# Altium schematic sheet Main.SchDoc
size 381 x 241 mm; SheetNumber: 1; SheetTotal: 1
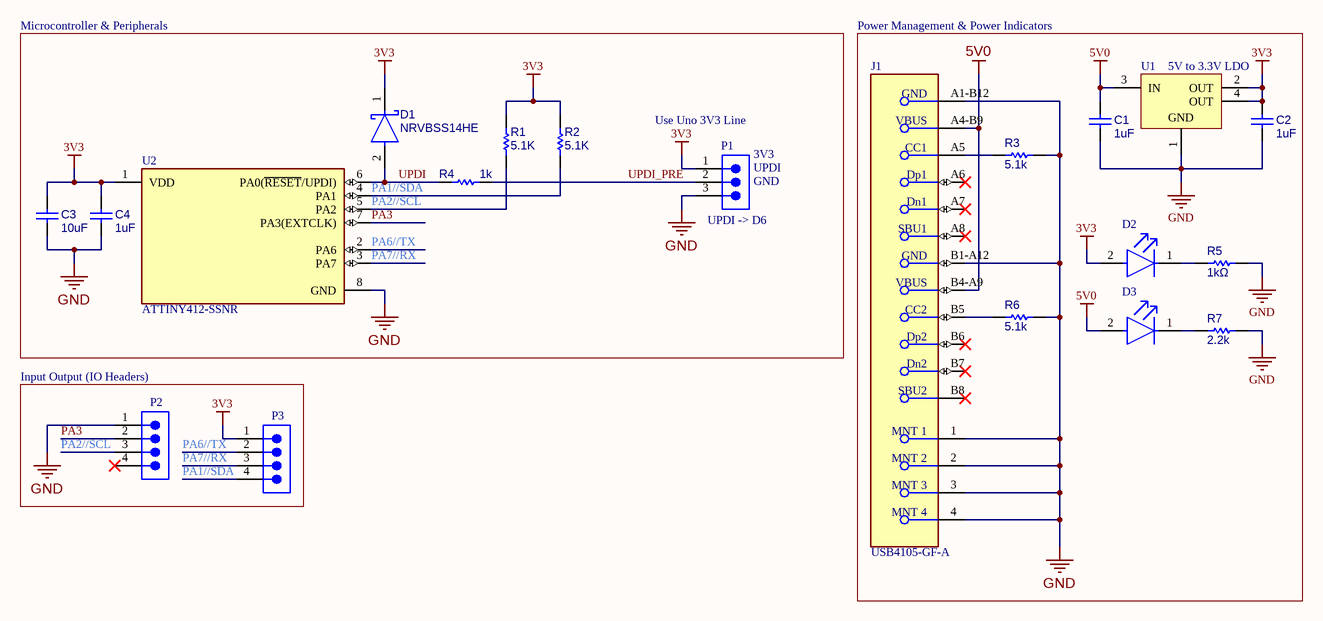
[diagram p0: Main.SchDoc]

## Parts
C1  1uF  [WCAP-CSGP_0603_L1.6W0.8H0.8_Reflow]
C2  1uF  [WCAP-CSGP_0603_L1.6W0.8H0.8_Reflow]
C3  10uF  [WCAP-CSGP_0603_L1.6W0.8H0.8_Reflow]
C4  1uF  [WCAP-CSGP_0603_L1.6W0.8H0.8_Reflow]
D1  NRVBSS14HE  [FP-477AD-MFG]
D2  LTST-C190KGKT  [FP-LTST-C190KGKT-MFG]  (value not drawn)
D3  LTST-C190KGKT  [FP-LTST-C190KGKT-MFG]  (value not drawn)
J1  USB4105-GF-A  [FP-USB4105-GF-A-MFG]
P1  61300311121  [61300311121]  (value not drawn)
P2  61300411121  [61300411121]  (value not drawn)
P3  61300411121  [61300411121]  (value not drawn)
R1  5.1K  [RESC1608X55X25NL10T15]
R2  5.1K  [RESC1608X55X25NL10T15]
R3  5.1k  [RESC1608X55X25NL10T15]
R4  1k  [RESC1608X55X25NL10T15]
R5  1kΩ  [RESC1608X55X25NL10T15]
R6  5.1k  [RESC1608X55X25NL10T15]
R7  2.2k  [RESC1608X55X25NL10T15]
U1  TLV1117LV33DCYR  [DCY0004A_N]  (value not drawn)
U2  ATTINY412-SSNR  [FP-C04-057-SN-MFG]

## Blocks framed on the sheet
Input Output (IO Headers): P2 P3

## Nets
3V3: C2.2 C3.2 C4.2 D1.1(C) D2.2(A) P1.1 P3.1 R1.1 R2.1 U1.2(OUT) U1.4(OUT) U2.1(VDD)
5V0: C1.2 D3.2(A) J1.A4-B9(VBUS) J1.B4-A9(VBUS) U1.3(IN)
GND: C1.1 C2.1 C3.1 C4.1 J1.1(MNT_1) J1.2(MNT_2) J1.3(MNT_3) J1.4(MNT_4) J1.A1-B12(GND) J1.B1-A12(GND) P1.3 P2.1 R3.1 R5.1 R6.1 R7.1 U1.1(GND) U2.8(GND)
PA1//SDA: P3.4 R2.2 U2.4(PA1)
PA2//SCL: P2.3 R1.2 U2.5(PA2)
PA3: P2.2 U2.7(PA3(EXTCLK))
PA6//TX: P3.2 U2.2(PA6)
PA7//RX: P3.3 U2.3(PA7)
UPDI: D1.2(A) R4.2 U2.6(PA0(~{RESET}/UPDI))
UPDI_PRE: P1.2 R4.1
NetD2_1: D2.1(C) R5.2
NetD3_1: D3.1(C) R7.2
NetJ1_A5: J1.A5(CC1) R3.2
NetJ1_B5: J1.B5(CC2) R6.2

Not connected (* = marked no-connect by the designer): J1 A6(Dp1)* A7(Dn1)* A8(SBU1)* B6(Dp2)* B7(Dn2)* B8(SBU2)*; P2 4*

## Notes on the sheet
- Microcontroller & Peripherals
- Power Management & Power Indicators
- (near U1) 5V to 3.3V LDO
- (near P1) Use Uno 3V3 Line
- (near P1) UPDI -> D6
- (near P1) UPDI
- (near P1) GND
- (near P1) 3V3

## Library data of the parts
C1-C4 = CMP-207839-000060-3: 10V tolerance
D1 = CMP-00278-93203856-2: NRVBSS14HE Rectifier Diode, Schottky, 1 Phase, 1 Element, 1A, 40V V(RRM), Silicon; Manufacturer Lifecycle Status: ACTIVE; Capacitance: 55pF; Max Forward Surge Current (Ifsm): 25A; Peak Reverse Current: 5µA; Max Junction Temperature (Tj): 150°C; Forward Current: 1A; Min Operating Temperature: -55°C; NexarPartId: 93203856; Reverse Voltage: 40V; Max Operating Temperature: 150°C; RoHS: Compliant; Lifecycle Status: Production; Max Repetitive Reverse Voltage (Vrrm): 40V; Height: 750µm
D2 D3 = CMP-2000-05197-2: LED GREEN CLEAR CHIP SMD; Test Current: 20mA; Power Rating: 75mW; Forward Voltage: 2V; Wavelength: 574nm; Number of LEDs: 1; Reverse Voltage: 5V; Dominant Wavelength: 571nm; Lens Style: Diffused; Luminous Intensity: 35mcd; Forward Current: 30mA; Viewing Angle: 130°; Lens Color: Colorless; Width: 0.8mm; Case Code (Imperial): 0603; Case Code (Metric): 1608; Number of Pins: 2; Radiation Hardening: No; Package Quantity: 1; Lead Free: Lead Free; Lens Transparency: Clear; Depth: 0.8mm; Power Dissipation: 75mW; Mount: Surface Mount; Max Operating Temperature: 85°C; Case/Package: 0603; Height: 0.8mm; Illumination Color: Green; Color: Green; Length: 1.6mm; Packaging: Tape and Reel; Number of Elements: 1; Min Operating Temperature: -55°C
J1 = CMP-245163-000001-1: CONN RCPT USB2.0 TYPEC 5A; Manufacturer: GCT; Voltage Rating: 20V; Is Female: yes; Current Rating: 5/6.25/1.25/0.25A; Number Of Contacts: 16; Conn Orientation: Right Angle; Device Class L1: Connectors; Category: Conn; Lead Free: Yes; RoHS: TRUE; Temperature Range High: +85°C; Digikey Description: CONN RCPT USB2.0 TYPEC 5A; Device Class L3: unset; ComponentLink2Description: Datasheet; Manufacturer Part Number: USB4105-GF-A; Package: 0; Usb Standard: USB 2.0; Device Class L2: USB Connectors; Automotive: No; Temperature Range Low: -40°C; Height: 3.46mm; Temperature: -40°C to +85°C; Contact Material: Gold,Nickel; ComponentLink2URL: https://gct.co/files/drawings/usb4105.pdf; Octopart: https://octopart.com/usb4105-gf-a-gct-106627878
P1 = CMP-1502-01062-3: NexarPartId: 32855521; Current Rating: 3A; Voltage Rating: 250V; Number of Positions: 3; Pitch: 2.54mm; Contact Resistance: 20mΩ; Connector Type: Male Pin; Gender: Male; REACH SVHC: Unknown; Packaging: Bulk; Contact Material: Copper; Min Operating Temperature: -40°C; Number of Rows: 1; Orientation: Vertical; RoHS: Compliant; Contact Plating: Gold; Max Operating Temperature: 105°C; Mount: Through Hole; Height: 8.94mm; Operating Supply Voltage: 250V; Number of Pins: 3; Contact Mating Length: 5.9944mm; Number of Contacts: 3; Color: Black; Lead Free: Lead Free; Lead Pitch: 2.54mm; Termination: Solder
P2 P3 = CMP-1502-01064-3: NexarPartId: 32855522; Operating Supply Voltage: 250V; Pitch: 2.54mm; Contact Resistance: 20mΩ; Number of Positions: 4; Current Rating: 3A; Connector Type: Male Pin; Gender: Male; Contact Plating: Gold; Height: 8.89mm; Lead Pitch: 2.54mm; Lead Free: Lead Free; Contact Mating Length: 5.9944mm; Number of Rows: 1; Termination: Solder; Packaging: Bulk; REACH SVHC: Unknown; Min Operating Temperature: -40°C; RoHS: Compliant; Number of Contacts: 4; Voltage Rating: 250V; Color: Black; Max Operating Temperature: 105°C; Contact Material: Copper; Mount: Through Hole; Orientation: Vertical; Number of Pins: 4
R1-R7 = CMP-2000-04186-1
U1 = CMP-0395-00503-2: Single Output LDO, 1 A, Fixed 3.3 V Output, 2 to 5.5 V Input, 4-pin SOT-223 (DCY), -40 to 125 degC, Green (RoHS & no Sb/Br); Manufacturer: Texas Instruments; Vout Adj(Min)(V): 3.3; Vdo(Typ)(mV): 1200; Iq(Typ)(mA): 0.05; Accuracy(%): 2; Iout(Max)(A): 1; SubFamily: Single Channel LDO; Vin(Max)(V): 5.5; PackageReference: DCY0004A; PackageDescription: 4-Pin Plastic Small Outline, Body 3.5 x 6.5 mm, Pitch 2.3 mm; Vout Adj(Max)(V): 3.3; Mounting Technology: Surface Mount; ComponentLink2Description: Datasheet; ComponentLink1Description: Manufacturer URL; PartNumber: TLV1117LV33DCYR; ComponentLink3Description: Package Specification; ComponentLink1URL: http://www.ti.com/; ComponentLink2URL: http://www.ti.com/general/docs/lit/getliterature.tsp?genericPartNumber=TLV1117LV33&fileType=pdf; Fixed Output Options(V): 3.3; PackageVersion: 4202506/B; Vin(Min)(V): 2; DatasheetVersion: SBVS160A; Eco-Plan: Green (RoHS & no Sb/Br); ComponentLink3URL: http://www.ti.com/litv/pdf/mpds094a; Code_JEDEC: TO-261
U2 = CMP-06276-000158-1: IC MCU 8BIT 4KB FLASH 8SOIC; Peripherals: Brown-out Detect/Reset; Number of I/Os: 6; Core Architecture: AVR; Oscillator Type: Internal; Interface: I2C; Frequency: 20MHz; Memory Type: FLASH; Memory Size: 4KB; Max Operating Temperature: 105°C; Min Operating Temperature: -40°C; RoHS Compliant: Yes; Number of Pins: 8; Case/Package: SOIC; Packaging: Cut Tape